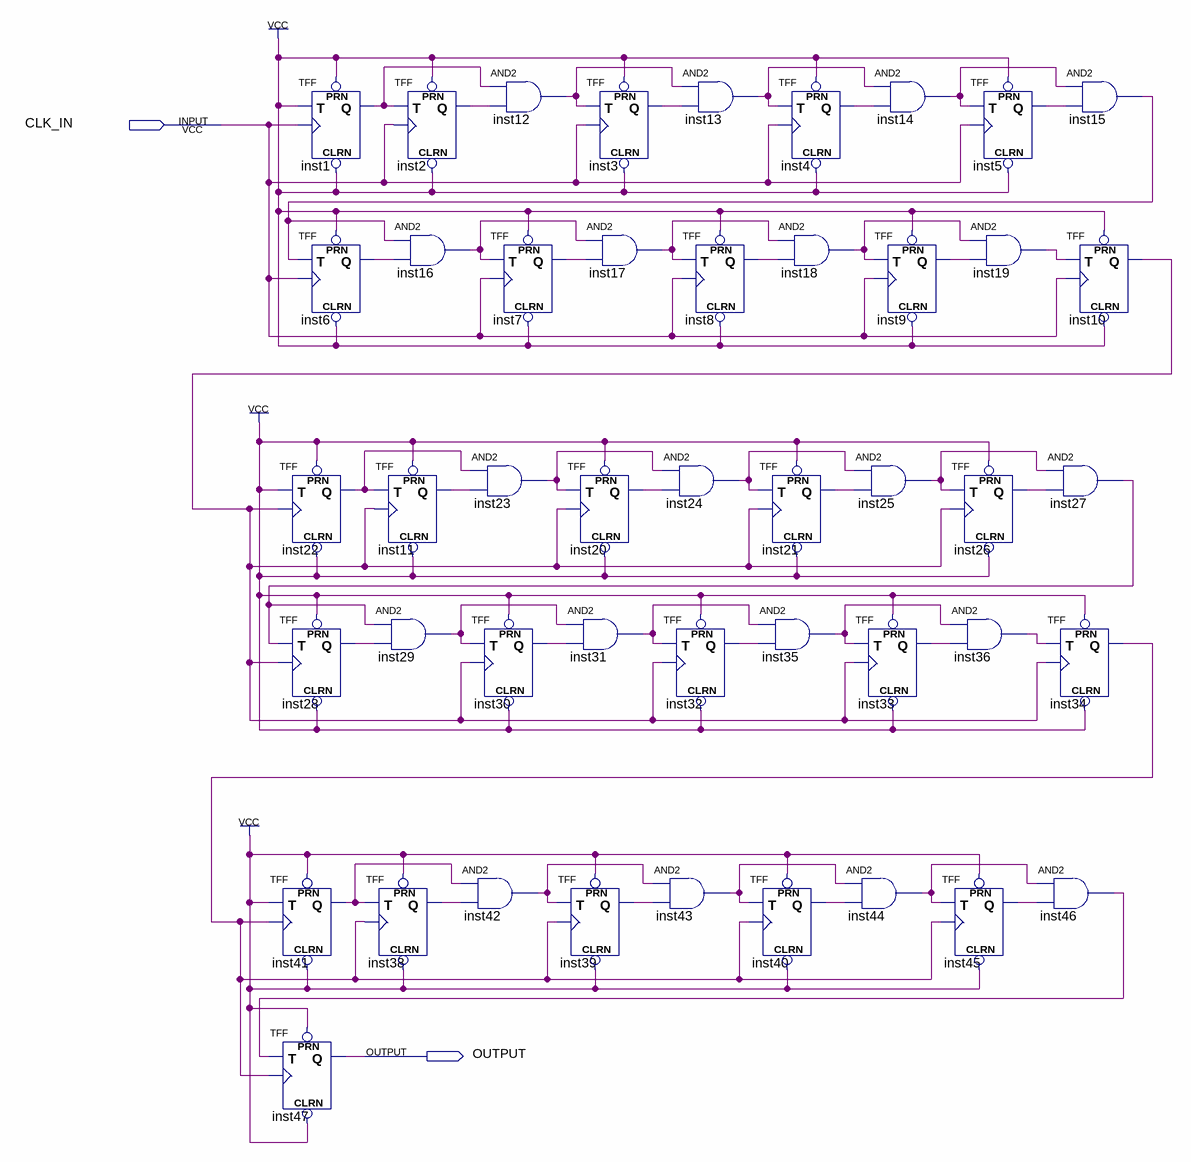
[diagram p0: schematic sheet]
// Quartus schematic FinProjStep4.bdf as structural Verilog: 46 symbols, 2 pins
module FinProjStep4 (
  input  CLK_IN,
  output OUTPUT
);

  wire inst1_q, inst2_q, inst3_q, inst4_q, inst5_q, inst6_q, inst7_q, inst8_q, inst9_q, inst10_q, inst11_q,
       inst12_out, inst13_out, inst14_out, inst15_out, inst16_out, inst17_out, inst18_out, inst19_out,
       inst20_q, inst21_q, inst22_q, inst23_out, inst24_out, inst25_out, inst26_q, inst27_out, inst28_q,
       inst29_out, inst30_q, inst31_out, inst32_q, inst33_q, inst34_q, inst35_out, inst36_out, inst38_q,
       inst39_q, inst40_q, inst41_q, inst42_out, inst43_out, inst44_out, inst45_q, inst46_out;

  TFF inst1 (.PRN(1'b1), .CLRN(1'b1), .T(1'b1), .CLK(CLK_IN), .Q(inst1_q));
  TFF inst6 (.PRN(1'b1), .CLRN(1'b1), .T(inst15_out), .CLK(CLK_IN), .Q(inst6_q));
  TFF inst22 (.PRN(1'b1), .CLRN(1'b1), .T(1'b1), .CLK(inst10_q), .Q(inst22_q));
  TFF inst28 (.PRN(1'b1), .CLRN(1'b1), .T(inst27_out), .CLK(inst10_q), .Q(inst28_q));
  TFF inst41 (.PRN(1'b1), .CLRN(1'b1), .T(1'b1), .CLK(inst34_q), .Q(inst41_q));
  TFF inst47 (.PRN(1'b1), .CLRN(1'b1), .T(inst46_out), .CLK(inst34_q), .Q(OUTPUT));
  TFF inst2 (.PRN(1'b1), .CLRN(1'b1), .T(inst1_q), .CLK(CLK_IN), .Q(inst2_q));
  and inst16 (inst16_out, inst15_out, inst6_q);
  TFF inst11 (.PRN(1'b1), .CLRN(1'b1), .T(inst22_q), .CLK(inst10_q), .Q(inst11_q));
  and inst29 (inst29_out, inst27_out, inst28_q);
  TFF inst38 (.PRN(1'b1), .CLRN(1'b1), .T(inst41_q), .CLK(inst34_q), .Q(inst38_q));
  and inst12 (inst12_out, inst1_q, inst2_q);
  TFF inst7 (.PRN(1'b1), .CLRN(1'b1), .T(inst16_out), .CLK(CLK_IN), .Q(inst7_q));
  and inst23 (inst23_out, inst22_q, inst11_q);
  TFF inst30 (.PRN(1'b1), .CLRN(1'b1), .T(inst29_out), .CLK(inst10_q), .Q(inst30_q));
  and inst42 (inst42_out, inst41_q, inst38_q);
  TFF inst20 (.PRN(1'b1), .CLRN(1'b1), .T(inst23_out), .CLK(inst10_q), .Q(inst20_q));
  and inst31 (inst31_out, inst29_out, inst30_q);
  TFF inst39 (.PRN(1'b1), .CLRN(1'b1), .T(inst42_out), .CLK(inst34_q), .Q(inst39_q));
  TFF inst3 (.PRN(1'b1), .CLRN(1'b1), .T(inst12_out), .CLK(CLK_IN), .Q(inst3_q));
  and inst17 (inst17_out, inst16_out, inst7_q);
  and inst13 (inst13_out, inst12_out, inst3_q);
  TFF inst8 (.PRN(1'b1), .CLRN(1'b1), .T(inst17_out), .CLK(CLK_IN), .Q(inst8_q));
  and inst24 (inst24_out, inst23_out, inst20_q);
  TFF inst32 (.PRN(1'b1), .CLRN(1'b1), .T(inst31_out), .CLK(inst10_q), .Q(inst32_q));
  and inst43 (inst43_out, inst42_out, inst39_q);
  TFF inst4 (.PRN(1'b1), .CLRN(1'b1), .T(inst13_out), .CLK(CLK_IN), .Q(inst4_q));
  and inst18 (inst18_out, inst17_out, inst8_q);
  TFF inst21 (.PRN(1'b1), .CLRN(1'b1), .T(inst24_out), .CLK(inst10_q), .Q(inst21_q));
  and inst35 (inst35_out, inst31_out, inst32_q);
  TFF inst40 (.PRN(1'b1), .CLRN(1'b1), .T(inst43_out), .CLK(inst34_q), .Q(inst40_q));
  and inst14 (inst14_out, inst13_out, inst4_q);
  TFF inst9 (.PRN(1'b1), .CLRN(1'b1), .T(inst18_out), .CLK(CLK_IN), .Q(inst9_q));
  and inst25 (inst25_out, inst24_out, inst21_q);
  TFF inst33 (.PRN(1'b1), .CLRN(1'b1), .T(inst35_out), .CLK(inst10_q), .Q(inst33_q));
  and inst44 (inst44_out, inst43_out, inst40_q);
  TFF inst26 (.PRN(1'b1), .CLRN(1'b1), .T(inst25_out), .CLK(inst10_q), .Q(inst26_q));
  and inst36 (inst36_out, inst35_out, inst33_q);
  TFF inst45 (.PRN(1'b1), .CLRN(1'b1), .T(inst44_out), .CLK(inst34_q), .Q(inst45_q));
  TFF inst5 (.PRN(1'b1), .CLRN(1'b1), .T(inst14_out), .CLK(CLK_IN), .Q(inst5_q));
  and inst19 (inst19_out, inst18_out, inst9_q);
  and inst15 (inst15_out, inst14_out, inst5_q);
  TFF inst10 (.PRN(1'b1), .CLRN(1'b1), .T(inst19_out), .CLK(CLK_IN), .Q(inst10_q));
  and inst27 (inst27_out, inst25_out, inst26_q);
  TFF inst34 (.PRN(1'b1), .CLRN(1'b1), .T(inst36_out), .CLK(inst10_q), .Q(inst34_q));
  and inst46 (inst46_out, inst44_out, inst45_q);
endmodule
